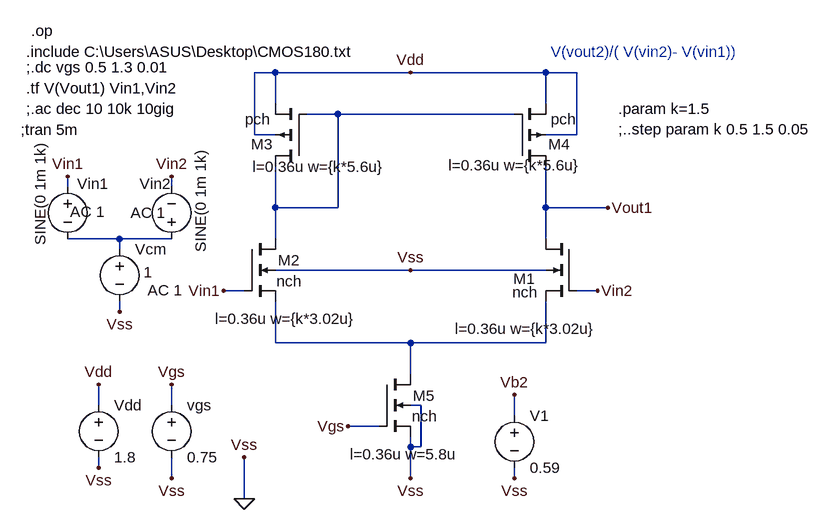
[diagram p0: schematic cascade two stage.asc]
cascade two stage.asc, the LTspice schematic file:
Version 4
SHEET 1 1412 680
WIRE 304 -160 272 -160
WIRE 512 -160 304 -160
WIRE 720 -160 512 -160
WIRE 768 -160 720 -160
WIRE 304 -112 304 -160
WIRE 720 -112 720 -160
WIRE 400 -96 352 -96
WIRE 672 -96 400 -96
WIRE 272 -64 272 -160
WIRE 304 -64 272 -64
WIRE 768 -64 768 -160
WIRE 768 -64 720 -64
WIRE -16 16 -16 0
WIRE 144 16 144 0
WIRE 304 48 304 -16
WIRE 400 48 400 -96
WIRE 400 48 304 48
WIRE 720 48 720 -16
WIRE 816 48 720 48
WIRE 64 96 -16 96
WIRE 144 96 64 96
WIRE 304 96 304 48
WIRE 720 96 720 48
WIRE 64 112 64 96
WIRE 512 144 304 144
WIRE 720 144 512 144
WIRE 256 176 224 176
WIRE 800 176 768 176
WIRE 64 208 64 192
WIRE 304 256 304 192
WIRE 512 256 304 256
WIRE 720 256 720 192
WIRE 720 256 512 256
WIRE 512 304 512 256
WIRE 32 352 32 320
WIRE 144 352 144 320
WIRE 528 352 512 352
WIRE 672 368 672 336
WIRE 464 384 416 384
WIRE 512 416 512 400
WIRE 528 416 528 352
WIRE 528 416 512 416
WIRE 32 448 32 432
WIRE 144 464 144 432
WIRE 512 464 512 416
WIRE 672 464 672 448
WIRE 256 496 256 432
FLAG 256 496 0
FLAG 256 432 Vss
FLAG 32 448 Vss
FLAG 64 208 Vss
FLAG 32 320 Vdd
FLAG 800 176 Vin2
FLAG 224 176 Vin1
FLAG 512 -160 Vdd
FLAG 512 144 Vss
FLAG -16 0 Vin1
FLAG 144 0 Vin2
FLAG 144 320 Vgs
FLAG 144 464 Vss
FLAG 416 384 Vgs
FLAG 512 464 Vss
FLAG 816 48 Vout1
FLAG 672 464 Vss
FLAG 672 336 Vb2
DATAFLAG 720 48 ""
DATAFLAG 720 48 ""
DATAFLAG 720 48 ""
DATAFLAG 720 48 ""
DATAFLAG 720 48 ""
DATAFLAG 720 48 ""
DATAFLAG 720 48 ""
DATAFLAG 720 48 ""
SYMBOL nmos4 768 96 M0
WINDOW 0 64 61 Left 2
WINDOW 3 60 82 Left 2
WINDOW 123 -29 138 Left 2
SYMATTR InstName M1
SYMATTR Value nch
SYMATTR Value2 l=0.36u w={k*3.02u}
SYMBOL voltage 32 336 R0
WINDOW 123 0 0 Left 0
WINDOW 39 0 0 Left 0
SYMATTR InstName Vdd
SYMATTR Value 1.8
SYMBOL voltage 64 96 R0
WINDOW 3 37 51 Left 2
WINDOW 123 43 79 Left 2
WINDOW 39 0 0 Left 0
SYMATTR Value 1
SYMATTR Value2 AC 1
SYMATTR InstName Vcm
SYMBOL pmos4 672 -16 M180
WINDOW 123 -102 1 Left 2
WINDOW 0 52 34 Left 2
SYMATTR Value2 l=0.36u w={k*5.6u}
SYMATTR InstName M4
SYMATTR Value pch
SYMBOL nmos4 256 96 R0
WINDOW 0 52 33 Left 2
WINDOW 3 50 65 Left 2
WINDOW 123 -45 123 Left 2
SYMATTR InstName M2
SYMATTR Value nch
SYMATTR Value2 l=0.36u w={k*3.02u}
SYMBOL voltage -16 0 R0
WINDOW 0 15 11 Left 2
WINDOW 3 -42 -52 VRight 2
WINDOW 123 4 54 Left 2
WINDOW 39 0 0 Left 0
SYMATTR InstName Vin1
SYMATTR Value SINE(0 1m 1k)
SYMATTR Value2 AC 1
SYMBOL voltage 144 112 M180
WINDOW 0 -49 101 Left 2
WINDOW 3 45 153 VLeft 2
WINDOW 123 -63 56 Left 2
WINDOW 39 0 0 Left 0
SYMATTR InstName Vin2
SYMATTR Value SINE(0 1m 1k)
SYMATTR Value2 AC 1
SYMBOL voltage 144 336 R0
WINDOW 123 0 0 Left 0
WINDOW 39 0 0 Left 0
SYMATTR InstName vgs
SYMATTR Value 0.75
SYMBOL pmos4 352 -16 R180
WINDOW 123 -120 -1 Left 2
WINDOW 0 52 34 Left 2
SYMATTR Value2 l=0.36u w={k*5.6u}
SYMATTR InstName M3
SYMATTR Value pch
SYMBOL nmos4 464 304 R0
WINDOW 0 52 33 Left 2
WINDOW 3 50 65 Left 2
WINDOW 123 -45 123 Left 2
SYMATTR InstName M5
SYMATTR Value nch
SYMATTR Value2 l=0.36u w=5.8u
SYMBOL voltage 672 352 R0
WINDOW 123 0 0 Left 0
WINDOW 39 0 0 Left 0
SYMATTR InstName V1
SYMATTR Value 0.59
TEXT -80 -192 Left 2 !.include C:\\Users\\ASUS\\Desktop\\CMOS180.txt
TEXT -72 -224 Left 2 !.op
TEXT -80 -136 Left 2 !.tf V(Vout1) Vin1,Vin2
TEXT -80 -104 Left 2 !;.ac dec 10 10k 10gig
TEXT -88 -72 Left 2 !;tran 5m
TEXT -80 -168 Left 2 !;.dc vgs 0.5 1.3 0.01
TEXT 832 -104 Left 2 !.param k=1.5\n;..step param k 0.5 1.5 0.05
TEXT 728 -192 Left 2 ;V(vout2)/( V(vin2)- V(vin1))

The netlist it stands for:
* cascade two stage.asc
M1 Vout1 Vin2 N003 0 nch l=0.36u w={k*3.02u}
Vdd Vdd 0 1.8
Vcm N002 0 1 AC 1
M4 Vout1 N001 Vdd Vdd pch l=0.36u w={k*5.6u}
M2 N001 Vin1 N003 0 nch l=0.36u w={k*3.02u}
Vin1 Vin1 N002 SINE(0 1m 1k) AC 1
Vin2 N002 Vin2 SINE(0 1m 1k) AC 1
vgs Vgs 0 0.75
M3 N001 N001 Vdd Vdd pch l=0.36u w={k*5.6u}
M5 N003 Vgs 0 0 nch l=0.36u w=5.8u
V1 Vb2 0 0.59
.model NMOS NMOS
.model PMOS PMOS
.lib standard.mos
.include C:\Users\ASUS\Desktop\CMOS180.txt
.op
.tf V(Vout1) Vin1,Vin2
;.ac dec 10 10k 10gig
;tran 5m
;.dc vgs 0.5 1.3 0.01
.param k=1.5
;..step param k 0.5 1.5 0.05
* V(vout2)/( V(vin2)- V(vin1))
.backanno
.end